# EAGLE design EEPROM ONLY memory board (EAGLE 9.3.0)
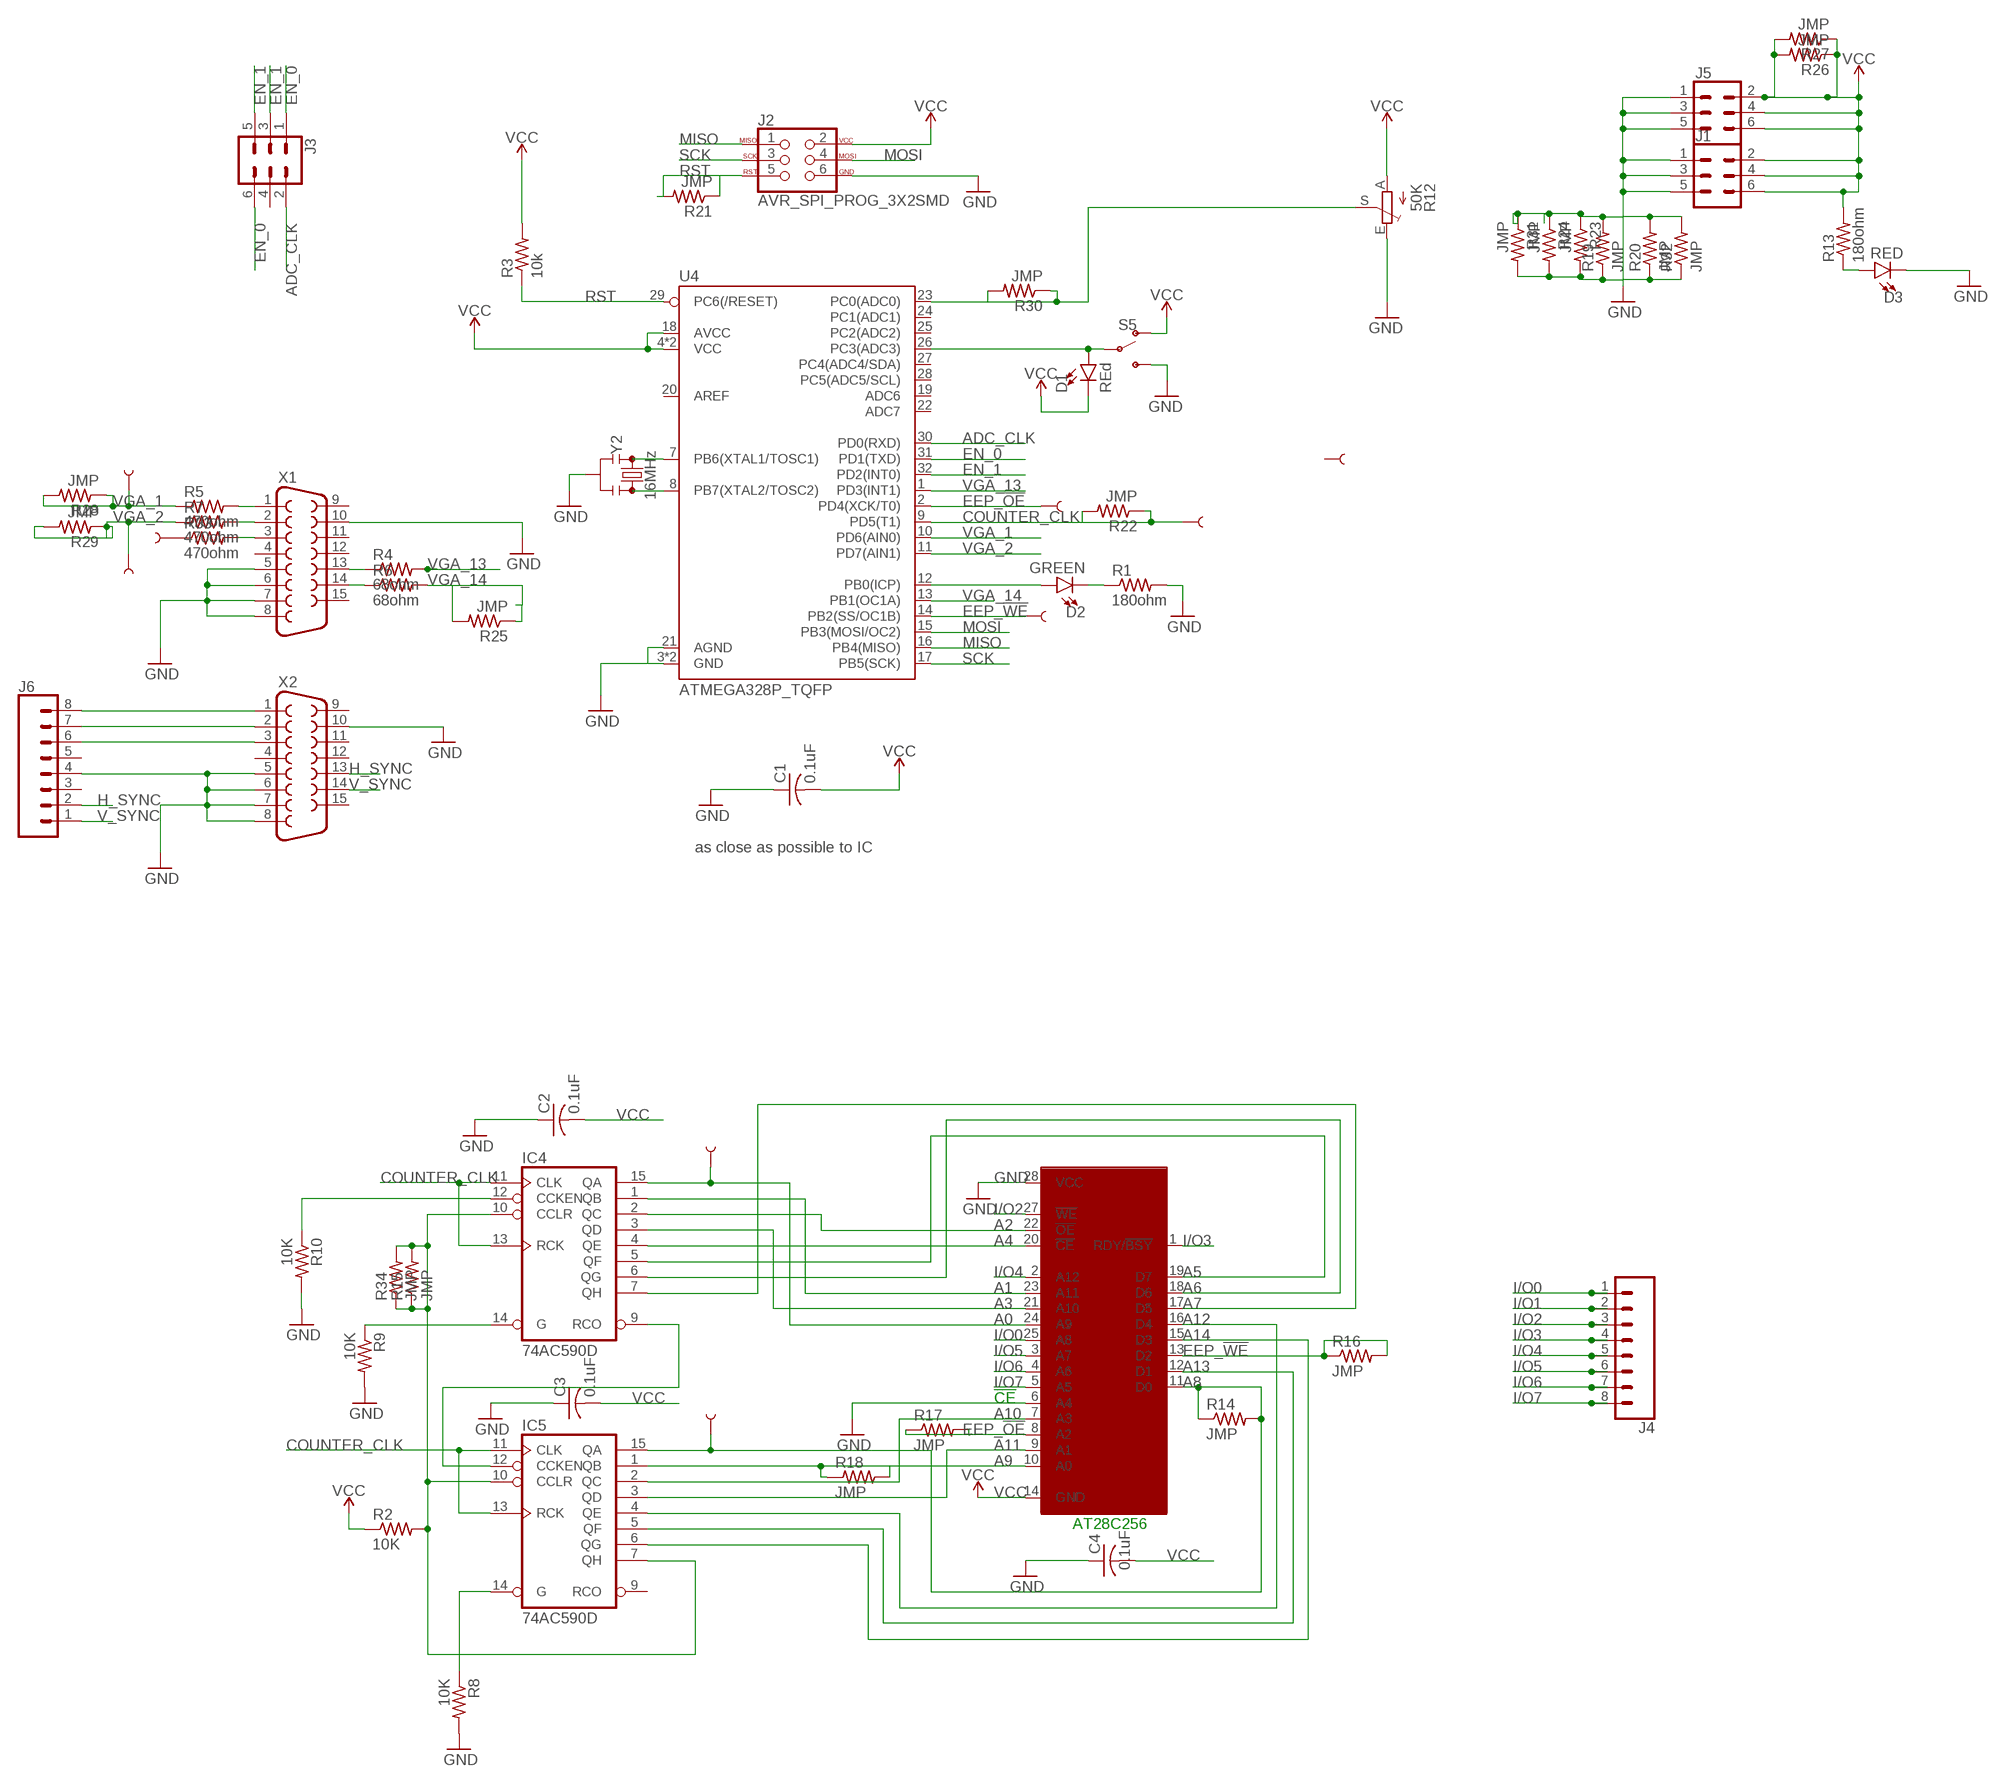
[diagram p0: schematic, sheet 1]

## Parts
C1  0.1uF  C-USC1206  [C1206]
C2  0.1uF  C-USC1206  [C1206]
C3  0.1uF  C-USC1206  [C1206]
C4  0.1uF  C-USC1206  [C1206]
D1  REd  LED-RED1206  [LED-1206]
D2  GREEN  LED-RED1206  [LED-1206]
D3  RED  LED-RED1206  [LED-1206]
IC1  28C64AVS  [VSOP28-8X13]
IC4  74AC590D  [SO16]
IC5  74AC590D  [SO16]
J1  CONN_03X2FEMALE_SMD  [2X3_SMD]
J2  AVR_SPI_PROG_3X2SMD  [2X3_SMT_POSTS]
J3  CONN_03X2FEMALE_SMD  [2X3_SMD]
J4  CONN_08SMD-STRAIGHT-ALT-FEMALE  [1X08_SMD_ALT]
J5  CONN_03X2FEMALE_SMD  [2X3_SMD]
J6  CONN_08SMD-STRAIGHT-ALT-FEMALE  [1X08_SMD_ALT]
R1  180ohm  R-US_R1206  [R1206]
R2  10K  R-US_R1206  [R1206]
R3  10k  R-US_R1206  [R1206]
R4  68ohm  R-US_R1206  [R1206]
R5  470ohm  R-US_R1206  [R1206]
R6  68ohm  R-US_R1206  [R1206]
R7  470ohm  R-US_R1206  [R1206]
R8  10K  R-US_R1206  [R1206]
R9  10K  R-US_R1206  [R1206]
R10  10K  R-US_R1206  [R1206]
R12  50K  TRIM_EU-CA9V  [CA9V]
R13  180ohm  R-US_R1206  [R1206]
R14  JMP  R-US_R1206  [R1206]
R15  JMP  R-US_R1206  [R1206]
R16  JMP  R-US_R1206  [R1206]
R17  JMP  R-US_R1206  [R1206]
R18  JMP  R-US_R1206  [R1206]
R19  JMP  R-US_R1206  [R1206]
R20  JMP  R-US_R1206  [R1206]
R21  JMP  R-US_R1206  [R1206]
R22  JMP  R-US_R1206  [R1206]
R23  JMP  R-US_R1206  [R1206]
R24  JMP  R-US_R1206  [R1206]
R25  JMP  R-US_R1206  [R1206]
R26  JMP  R-US_R1206  [R1206]
R27  JMP  R-US_R1206  [R1206]
R28  JMP  R-US_R1206  [R1206]
R29  JMP  R-US_R1206  [R1206]
R30  JMP  R-US_R1206  [R1206]
R31  JMP  R-US_R1206  [R1206]
R32  JMP  R-US_R1206  [R1206]
R33  470ohm  R-US_R1206  [R1206]
R34  JMP  R-US_R1206  [R1206]
RX1  TEST-POINT3  [PAD.03X.03]
RX2  TEST-POINT3  [PAD.03X.03]
RX3  TEST-POINT3  [PAD.03X.03]
RX4  TEST-POINT3  [PAD.03X.03]
RX5  TEST-POINT3  [PAD.03X.03]
RX6  TEST-POINT3  [PAD.03X.03]
RX7  TEST-POINT3  [PAD.03X.03]
RX8  TEST-POINT3  [PAD.03X.03]
RX9  TEST-POINT3  [PAD.03X.03]
S5  SWITCH-SPDT-SMD-AYZ0202  [SWITCH_DPDT_SMD_AYZ0202]
U4  ATMEGA328P_TQFP  [TQFP32-08]
X1  F15HP  [F15HP]
X2  F15HP  [F15HP]
Y2  16MHz  RESONATOR-16MHZSMD_3.2X1.3  [RESONATOR-SMD-3.2X1.3]

## Nets
A0: IC1.24(A9) IC4.15(QA) RX5.P$1
A1: IC1.23(A11) IC4.1(QB)
A2: IC1.22(!OE) IC4.2(QC)
A3: IC1.21(A10) IC4.3(QD)
A4: IC1.20(!CE) IC4.4(QE)
A5: IC1.19(D7) IC4.5(QF)
A6: IC1.18(D6) IC4.6(QG)
A7: IC1.17(D5) IC4.7(QH)
A8: IC1.11(D0) IC5.15(QA) R14.1 R14.2 RX6.P$1
A9: IC1.10(A0) IC5.1(QB) R18.1 R18.2
A10: IC1.7(A3) IC5.2(QC)
A11: IC1.9(A1) IC5.3(QD)
A12: IC1.16(D4) IC5.4(QE)
A13: IC1.12(D1) IC5.5(QF)
A14: IC1.15(D3) IC5.6(QG)
ADC_CLK: J3.2 U4.30(PD0(RXD))
COUNTER_CLK: IC4.11(CLK) IC4.13(RCK) IC5.11(CLK) IC5.13(RCK) R22.1 R22.2 RX3.P$1 U4.9(PD5(T1))
EEP_!OE: IC1.8(A2) R17.1 R17.2 RX2.P$1 U4.2(PD4(XCK/T0))
EEP_!WE: IC1.13(D2) R16.1 R16.2 RX4.P$1 U4.14(PB2(SS/OC1B))
EN_0: J3.1 J3.6 U4.31(PD1(TXD))
EN_1: J3.3 J3.5 U4.32(PD2(INT0))
GND: C1.1 C2.1 C3.1 C4.1 D3.C IC1.6(A4) IC1.28(VCC) J1.1 J1.3 J1.5 J2.6 J5.1 J5.3 J5.5 J6.4 R1.2 R8.2 R9.2 R10.2 R12.E R19.1 R19.2 R20.1 R20.2 R23.1 R23.2 R24.1 R24.2 R31.1 R31.2 R32.1 R32.2 S5.3(S) U4.3(GND) U4.5(GND) U4.21(AGND) X1.5 X1.6 X1.7 X1.8 X1.10 X2.5 X2.6 X2.7 X2.8 X2.10 Y2.2
H_SYNC: J6.2 X2.13
I/O0: IC1.25(A8) J4.1
I/O1: J4.2
I/O2: IC1.27(!WE) J4.3
I/O3: IC1.1(RDY/!BSY) J4.4
I/O4: IC1.2(A12) J4.5
I/O5: IC1.3(A7) J4.6
I/O6: IC1.4(A6) J4.7
I/O7: IC1.5(A5) J4.8
MISO: J2.1 U4.16(PB4(MISO))
MOSI: J2.4 U4.15(PB3(MOSI/OC2))
N$1: R5.2 X1.1
N$2: R7.2 X1.2
N$3: D3.A R13.1
N$4: R4.1 X1.13
N$5: R6.1 X1.14
N$6: IC4.9(RCO) IC5.12(CCKEN)
N$7: U4.7(PB6(XTAL1/TOSC1)) Y2.1
N$8: U4.8(PB7(XTAL2/TOSC2)) Y2.3
N$9: IC5.14(G) R8.1
N$10: IC4.14(G) R9.1
N$11: IC4.12(CCKEN) R10.1
N$12: IC4.10(CCLR) IC5.7(QH) IC5.10(CCLR) R2.2 R15.1 R15.2 R34.1 R34.2
N$13: D1.A S5.2(P) U4.26(PC3(ADC3))
N$14: J6.8 X2.1
N$15: J6.7 X2.2
N$16: D2.A U4.12(PB0(ICP))
N$17: R33.2 X1.3
N$18: D2.C R1.1
N$19: R33.1 RX7.P$1
N$23: J6.6 X2.3
N$86: R12.S R30.1 R30.2 U4.23(PC0(ADC0))
RST: J2.5 R3.1 R21.1 R21.2 U4.29(PC6(/RESET))
SCK: J2.3 U4.17(PB5(SCK))
V_SYNC: J6.1 X2.14
VCC: C1.2 C2.2 C3.2 C4.2 D1.C IC1.14(GND) J1.2 J1.4 J1.6 J2.2 J5.2 J5.4 J5.6 R2.1 R3.2 R12.A R13.2 R26.1 R26.2 R27.1 R27.2 S5.1(O) U4.4(VCC) U4.6(VCC) U4.18(AVCC)
VGA_1: R5.1 R28.1 R28.2 RX8.P$1 U4.10(PD6(AIN0))
VGA_2: R7.1 R29.1 R29.2 RX9.P$1 U4.11(PD7(AIN1))
VGA_13: R4.2 U4.1(PD3(INT1))
VGA_14: R6.2 R25.1 R25.2 U4.13(PB1(OC1A))
Unconnected: IC5.9(RCO) J3.4 J6.3 J6.5 RX1.P$1 U4.19(ADC6) U4.20(AREF) U4.22(ADC7) U4.24(PC1(ADC1)) U4.25(PC2(ADC2)) U4.27(PC4(ADC4/SDA)) U4.28(PC5(ADC5/SCL)) X1.4 X1.9 X1.11 X1.12 X1.15 X2.4 X2.9 X2.11 X2.12 X2.15

## Notes on the sheet
- as close as possible to IC
- !CE
- AT28C256

## Power pins joined to a net without a drawn wire
GND: IC4.8(GND) IC5.8(GND)
VCC: IC4.16(VCC) IC5.16(VCC)

## Library data of the parts
C1-C4 = adafruit:C-US: CAPACITOR, American symbol
D1 D2 = SparkFun-LED:LED-RED: Red SMD LED Used in manufacturing of most products at SparkFun Packages: 0603 - SMD 0603 package [Product Link] <http://docs.avagotech.com/docs/AV02-0551EN> 0603 SMART - SMD 0603 SMART package ( more efficient and expensive)[Product Link] <http://www.osram-os.com/Graphics/XPic2/00077099_0.pdf> 1206 - SMD1206 package [Product Link] <https://www.sparkfun.com/datasheets/DevTools/LilyPad/Q150OVS4.pdff> SparkFun Products: Pro Mini 328 -5V <https://www.sparkfun.com/products/821> RedBoard <https://www.sparkfun.com/products/12757> IOIO-OTG <https://www.sparkfun.com/products/13613>; PROD_ID: DIO-09912; VALUE: RED
D3 = SparkFun-LED:LED-RED: Red SMD LED Used in manufacturing of most products at SparkFun Packages: 0603 - SMD 0603 package [Product Link] <http://docs.avagotech.com/docs/AV02-0551EN> 0603 SMART - SMD 0603 SMART package ( more efficient and expensive)[Product Link] <http://www.osram-os.com/Graphics/XPic2/00077099_0.pdf> 1206 - SMD1206 package [Product Link] <https://www.sparkfun.com/datasheets/DevTools/LilyPad/Q150OVS4.pdff> SparkFun Products: Pro Mini 328 -5V <https://www.sparkfun.com/products/821> RedBoard <https://www.sparkfun.com/products/12757> IOIO-OTG <https://www.sparkfun.com/products/13613>; PROD_ID: DIO-09912
IC1 = microchip:28*64A: CMOS EEPROM 64 K (8 K x 8), low voltage; OC_FARNELL: unknown; OC_NEWARK: unknown
IC4 IC5 = 74xx-eu:74*590: 8-bit binary COUNTER, output register
J1 J3 J5 = SparkFun-Connectors:CONN_03X2: Multi connection point. Often used as Generic Header-pin footprint for 0.1 inch spaced/style header connections You can populate with any combo of single row headers, but if you'd like an exact match, check these: Header - 2x3 (Male, 0.1") <https://www.sparkfun.com/products/12807> (PRT-12807) Header - 2x3 (Female, 0.1") <https://www.sparkfun.com/products/13010> (PRT-13010) 2x3 Pin Shrouded Header <https://www.sparkfun.com/products/10877> (PRT-10877) On any of the 0.1 inch spaced packages, you can populate with these: Break Away Headers - Straight <https://www.sparkfun.com/products/116> (PRT-00116) Break Away Male Headers - Right Angle <https://www.sparkfun.com/products/553> (PRT-00553) Female Headers <https://www.sparkfun.com/products/115> (PRT-00115) Break Away Headers - Machine Pin <https://www.sparkfun.com/products/117> (PRT-00117) Break Away Female Headers - Swiss Machine Pin <https://www.sparkfun.com/products/743> (PRT-00743) Special note: the shrouded connector mates well with our 3x2 ribbon cables: Ribbon Crimp Connector - 6-pin (2x3, Female) <https://www.sparkfun.com/products/10651> (PRT-10651) Ribbon Cable - 6 wire (15ft) <https://www.sparkfun.com/products/10646> (PRT-10646); PROD_ID: CONN-11290
J2 = SparkFun-Connectors:AVR_SPI_PROG_3X2: AVR ISP 6 Pin This is the reduced ISP connector for AVR programming. Common on Arduino. This footprint will take up less PCB space and can be used with a 10-pin to 6-pin adapter such as SKU: BOB-08508 **Special note about "TEST_POINT" package. The stop mask is on the top side, so if you want your programming test points to be on the bottom of your board, make sure to place this package on the bottom side of the board. This also ensure that the orientation to program from the bottom side will be correct. SparkFun Products: SparkFun ISP Pogo Adapter <https://www.sparkfun.com/products/11591> - NS Tiny AVR Programmer <https://www.sparkfun.com/products/11801> -PTH
J4 J6 = SparkFun-Connectors:CONN_08: Multi connection point. Often used as Generic Header-pin footprint for 0.1 inch spaced/style header connections On any of the 0.1 inch spaced packages, you can populate with these: Break Away Headers - Straight <https://www.sparkfun.com/products/116> (PRT-00116) Break Away Male Headers - Right Angle <https://www.sparkfun.com/products/553> (PRT-00553) Female Headers <https://www.sparkfun.com/products/115> (PRT-00115) Break Away Headers - Machine Pin <https://www.sparkfun.com/products/117> (PRT-00117) Break Away Female Headers - Swiss Machine Pin <https://www.sparkfun.com/products/743> (PRT-00743) Arduino Stackable Header - 8 Pin <https://www.sparkfun.com/products/9279> (PRT-09279) For SCREWTERMINALS and SPRING TERMINALS visit here: Screw Terimnals on SparkFun.com <https://www.sparkfun.com/search/results?term=Screw+Terminals> (5mm/3.5mm/2.54mm spacing) This device is also useful as a general connection point to wire up your design to another part of your project. Our various solder wires solder well into these plated through hole pads. Hook-Up Wire - Assortment (Stranded, 22 AWG) <https://www.sparkfun.com/products/11375> (PRT-11375) Hook-Up Wire - Assortment (Solid Core, 22 AWG) <https://www.sparkfun.com/products/11367> (PRT-11367) View the entire wire category on our website here <https://www.sparkfun.com/categories/141> Special notes: Molex polarized connector foot print use with SKU : PRT-08231 with associated crimp pins and housings. 1MM SMD Version SKU: PRT-10208 NOTES ON THE VARIANTS LOCK and LOCK_LONGPADS... This footprint was designed to help hold the alignment of a through-hole component (i.e. 6-pin header) while soldering it into place. You may notice that each hole has been shifted either up or down by 0.005 of an inch from it's more standard position (which is a perfectly straight line). This slight alteration caused the pins (the squares in the middle) to touch the edges of the holes. Because they are alternating, it causes a "brace" to hold the component in place. 0.005 has proven to be the perfect amount of "off-center" position when using our standard breakaway headers. Although looks a little odd when you look at the bare footprint, once you have a header in there, the alteration is very hard to notice. Also,if you push a header all the way into place, it is covered up entirely on the bottom side.; PROD_ID: CONN-10204; SF_ID: PRT-11543
R1-R10 R13-R34 = adafruit:R-US_: RESISTOR, American symbol
R12 = pot:TRIM_EU-: POTENTIOMETER
RX1-RX9 = SparkFun-Connectors:TEST-POINT: SparkFun Test Points Bare copper test points for troubleshooting or In-Circuit-Testing. These are used by our Production team for verifying production board runs using pogo-pins on test beds. SparkFun Products: SparkFun LSM9DS1 Breakout <https://www.sparkfun.com/products/13284> SparkFun PSOC <https://www.sparkfun.com/products/13714> SparkFun Load Cell Amplifier <https://www.sparkfun.com/products/13879>
S5 = SparkFun-Switches:SWITCH-SPDT: Single Pole, Double Throw (SPDT) Switch Single-pole, double-throw (SPDT) switch. Variant Overview SMD-AYZ0202 Surface Mount DPDT Switch <https://www.sparkfun.com/products/597> (COM-00597) Used on e.g. LilyPad Arduino USB - ATmega32U4 Board <https://www.sparkfun.com/products/12049> PTH-11.6X4.0MM SPDT Mini Power Switch <https://www.sparkfun.com/products/102> (COM-00102) Used on e.g. SparkFun Simon Says - Through-Hole Soldering Kit <https://www.sparkfun.com/products/10547> (KIT-10547) PTH-11.6X4.0MM-KIT KIT version of SPDT Mini Power Switch - Simplifies soldering by removing tStop of switch pins - only one side can be soldered. PTH-11.6X4.0MM-LOCK LOCK version of SPDT Mini Power Switch - Offset pins hold switch in place for easier soldering. SMD-RIGHT-ANGLE Surface Mount Right Angle Switch <https://www.sparkfun.com/products/10860> (COM-10860) Used on e.g. SparkFun ESP8266 Thing <https://www.sparkfun.com/products/13231>; PROD_ID: SWCH-08179; SF_ID: COM-00597
U4 = SparkFun-IC-Microcontroller:ATMEGA328P_TQFP: Popular 328P in QFP Storefront component: ATmega328 - TQFP <https://www.sparkfun.com/products/13448> (COM-13448) Datasheet <http://www.sparkfun.com/datasheets/Components/SMD/ATMega328.pdf> SparkFun Products SparkFun RedBoard - Programmed with Arduino <https://www.sparkfun.com/products/12757> (DEV-12757) Arduino Pro Mini 328 - 5V/16MHz <https://www.sparkfun.com/products/11113> (DEV-11113) Arduino Pro Mini 328 - 3.3V/8MHz <https://www.sparkfun.com/products/11114> (DEV-11114) SparkFun OpenLog <https://www.sparkfun.com/products/13712> (DEV-13712) SparkFun MicroView - OLED Arduino Module <https://www.sparkfun.com/products/12923> (DEV-12923) SparkFun Digital Sandbox <https://www.sparkfun.com/products/12651> (DEV-12651) SparkFun PicoBoard <https://www.sparkfun.com/products/11888> (WIG-11888) Arduino Fio <https://www.sparkfun.com/products/10116> (DEV-10116) LilyPad Arduino 328 Main Board <https://www.sparkfun.com/products/13342> (DEV-13342) SparkFun RedStick <https://www.sparkfun.com/products/13741> (DEV-13741) LilyPad MP3 <https://www.sparkfun.com/products/11013> (DEV-11013) LilyPad Arduino SimpleSnap <https://www.sparkfun.com/products/10941> (DEV-10941) SparkFun Stepoko <https://www.sparkfun.com/products/13899> (ROB-13899) SparkFun Geiger Counter <https://www.sparkfun.com/products/11345> (SEN-11345) SparkFun EL Sequencer <https://www.sparkfun.com/products/12781> (COM-12781) Arduino Pro 328 - 5V/16MHz <https://www.sparkfun.com/products/10915> (DEV-10915) CryptoCape <https://www.sparkfun.com/products/12773> (DEV-12773) SparkFun IR Thermometer Evaluation Board - MLX90614 <https://www.sparkfun.com/products/10740> (SEN-10740) SparkFun RedBot Mainboard <https://www.sparkfun.com/products/12097> (ROB-12097) Arduino Pro 328 - 3.3V/8MHz <https://www.sparkfun.com/products/10914> (DEV-10914) SparkFun Block for Intel® Edison - Arduino <https://www.sparkfun.com/products/13036> (DEV-13036) SparkFun Simon Says - Surface Mount Soldering Kit <https://www.sparkfun.com/products/10935> (KIT-10935) SparkFun 7-Segment Serial Display - Red <https://www.sparkfun.com/products/11441> (COM-11441) SparkFun 7-Segment Serial Display - White <https://www.sparkfun.com/products/11629> (COM-11629) SparkFun 7-Segment Serial Display - Yellow <https://www.sparkfun.com/products/11443> (COM-11443) SparkFun 7-Segment Serial Display - Kelly Green <https://www.sparkfun.com/products/11440> (COM-11440) SparkFun 7-Segment Serial Display - Blue <https://www.sparkfun.com/products/11442> (COM-11442) SparkFun OpenSegment Serial Display - 20mm (Blue) <https://www.sparkfun.com/products/11647> (COM-11647) SparkFun OpenSegment Serial Display - 20mm (Green) <https://www.sparkfun.com/products/11646> (COM-11646) SparkFun OpenSegment Serial Display - 20mm (White) <https://www.sparkfun.com/products/11648> (COM-11648) SparkFun OpenSegment Serial Display - 20mm (Red) <https://www.sparkfun.com/products/11644> (COM-11644) SparkFun OpenSegment Serial Display - 20mm (Yellow) <https://www.sparkfun.com/products/11645> (COM-11645) SparkFun OpenSegment Shield <https://www.sparkfun.com/products/13190> (DEV-13190); PROD_ID: IC-09069
X1 X2 = adafruit:F15: SUB-D HDH is also known as a 'right angle VGA' connector
Y2 = SparkFun-Clocks:RESONATOR-16MHZ: 16MHz Resonator Digikey Example <http://www.digikey.com/product-detail/en/murata-electronics-north-america/CSTCE16M0V53-R0/490-1198-1-ND/584635> Frequency: 16MHz Frequency Stability: ±0.3% Frequency Tolerance: ±0.5% Capacitance: 15pF SparkFun Products SparkFun OpenLog <https://www.sparkfun.com/products/13712> SparkFun MicroView - OLED Arduino Module <https://www.sparkfun.com/products/12923>; PROD_ID: XTAL-08900

## Board
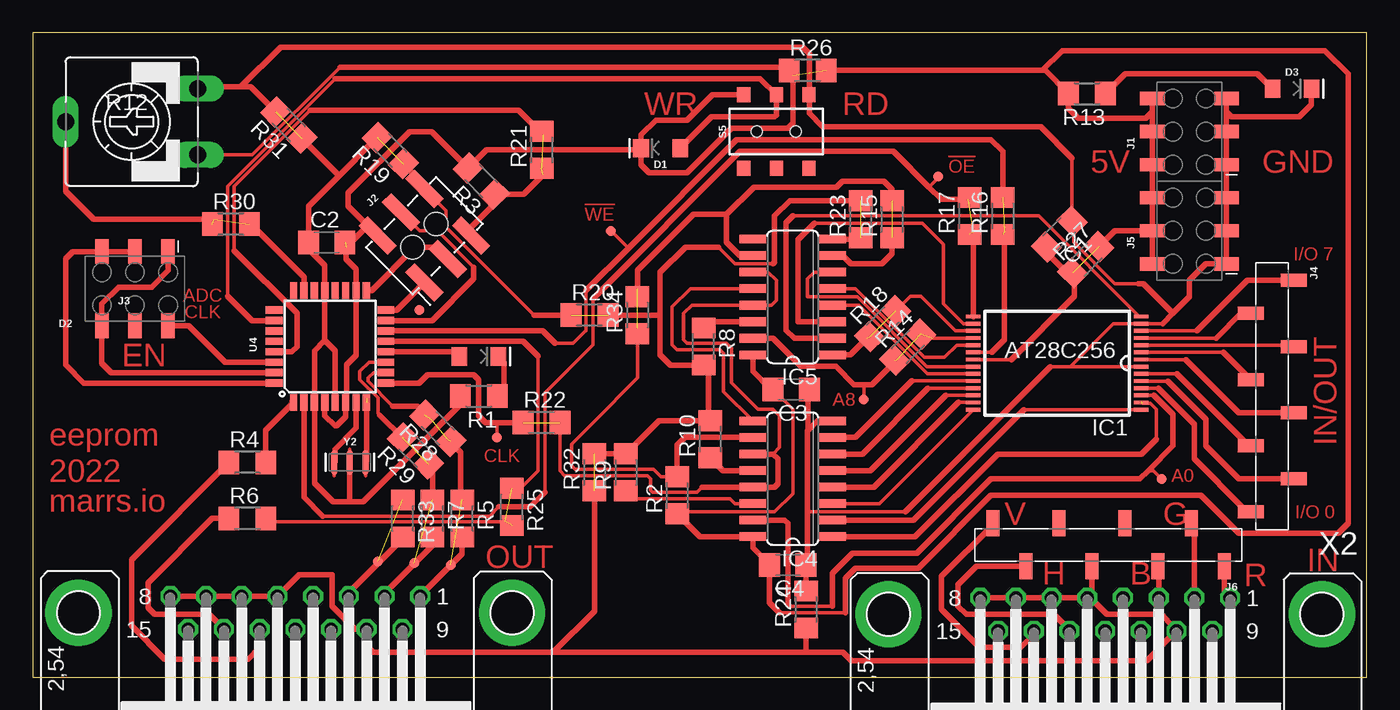
[diagram p1: board, top side]

Size 102.54 x 49.52 mm. Coordinates in mm from the lower left corner, seen from the top.
Outline: 0,0 102.54,0 102.54,49.52 0,49.52 0,0
Copper layers (1*16): Top 0.035mm / dielectric 1.5mm / Bottom 0.035mm
Design rules "default *": minimum track width 10mil, minimum drill 0.35mm, track to track 16mil, track to pad 6mil, pad to pad 6mil, via to via 6mil, smd to smd 16mil, copper to edge 40mil, drill to drill 6mil, minimum pad ring 10mil, minimum via ring 8mil, stop-mask expansion 4mil, vias tented up to drill 0mil, thermal gap 10mil

### Footprints (pad centres in the part's own frame; a part is rotated, then mirrored left to right if it is on the bottom)
C1206 = smd 1.6 x 1.8: 1 -1.4,0; 2 1.4,0
LED-1206 = smd 1.2 x 1.4: A -1.5,0; C 1.5,0
VSOP28-8X13 = smd 0.3 x 1.1: 1 0.275,-6.45; 2 0.825,-6.45; 3 1.375,-6.45; 4 1.925,-6.45; 5 2.475,-6.45; 6 3.025,-6.45; 7 3.575,-6.45; 8 3.575,6.45; 9 3.025,6.45; 10 2.475,6.45; 11 1.925,6.45; 12 1.375,6.45; 13 0.825,6.45; 14 0.275,6.45; 15 -0.275,6.45; 16 -0.825,6.45; 17 -1.375,6.45; 18 -1.925,6.45; 19 -2.475,6.45; 20 -3.025,6.45; 21 -3.575,6.45; 22 -3.575,-6.45; 23 -3.025,-6.45; 24 -2.475,-6.45; 25 -1.925,-6.45; 26 -1.375,-6.45; 27 -0.825,-6.45; 28 -0.275,-6.45
SO16 = smd 0.66 x 2.032: 1 -4.445,-3.073; 2 -3.175,-3.073; 3 -1.905,-3.073; 4 -0.635,-3.073; 5 0.635,-3.073; 6 1.905,-3.073; 7 3.175,-3.073; 8 4.445,-3.073; 9 4.445,3.073; 10 3.175,3.073; 11 1.905,3.073; 12 0.635,3.073; 13 -0.635,3.073; 14 -1.905,3.073; 15 -3.175,3.073; 16 -4.445,3.073
2X3_SMD = smd 1.02 x 1.9: 1 -2.54,-2.85; 2 -2.54,2.85; 3 0,-2.85; 4 0,2.85; 5 2.54,-2.85; 6 2.54,2.85
2X3_SMT_POSTS = smd 1 x 3.17: 1 -2.54,-2.54; 2 -2.54,2.54; 3 0,-2.54; 4 0,2.54; 5 2.54,-2.54; 6 2.54,2.54 | hole 1.8: -1.27,0; 1.27,0
1X08_SMD_ALT = smd 1 x 2: 1 0,-1.65; 2 -2.54,1.65; 3 -5.08,-1.65; 4 -7.62,1.65; 5 -10.16,-1.65; 6 -12.7,1.65; 7 -15.24,-1.65; 8 -17.78,1.65
R1206 = smd 1.6 x 1.803: 1 -1.422,0; 2 1.422,0
CA9V = drill 1.321 long: A -2.54,-5.08; E 2.54,-5.08; S 0,5.08
PAD.03X.03 = smd 0.762 x 0.762: P$1 0,0
SWITCH_DPDT_SMD_AYZ0202 = smd 1 x 1.15: 1 -2.5,2.825; 2 0,2.825; 3 2.5,2.825; 4 -2.5,-2.825; 5 0,-2.825; 6 2.5,-2.825 | hole 0.85: 1.5,0; -1.5,0
TQFP32-08 = smd 1.27 x 0.559: 1 -4.293,2.8; 2 -4.293,2; 3 -4.293,1.2; 4 -4.293,0.4; 5 -4.293,-0.4; 6 -4.293,-1.2; 7 -4.293,-2; 8 -4.293,-2.8; 17 4.293,-2.8; 18 4.293,-2; 19 4.293,-1.2; 20 4.293,-0.4; 21 4.293,0.4; 22 4.293,1.2; 23 4.293,2; 24 4.293,2.8 | smd 0.559 x 1.27: 9 -2.8,-4.293; 10 -2,-4.293; 11 -1.2,-4.293; 12 -0.4,-4.293; 13 0.4,-4.293; 14 1.2,-4.293; 15 2,-4.293; 16 2.8,-4.293; 25 2.8,4.293; 26 2,4.293; 27 1.2,4.293; 28 0.4,4.293; 29 -0.4,4.293; 30 -1.2,4.293; 31 -2,4.293; 32 -2.8,4.293
F15HP = drill 1.016 octagon: 1 -9.601,-1.27; 2 -6.858,-1.27; 3 -4.115,-1.27; 4 -1.372,-1.27; 5 1.372,-1.27; 6 4.115,-1.27; 7 6.858,-1.27; 8 9.601,-1.27; 9 -8.23,1.27; 10 -5.486,1.27; 11 -2.743,1.27; 12 0,1.27; 13 2.743,1.27; 14 5.486,1.27; 15 8.23,1.27 | drill 3.302 pad 5.08: G1 -16.662,0; G2 16.662,0
RESONATOR-SMD-3.2X1.3 = smd 0.45 x 1.905: 1 -1.2,0; 2 0,0; 3 1.2,0

### Placement (x,y rotation side)
C1  78.89,34.04 225 top
C2  22.61,33.4 0 top
C3  58.29,22.1 180 top
C4  58.04,8.64 180 top
D1  48.26,40.64 180 top
D2  34.29,24.64 0 top
D3  96.77,45.21 0 top
IC1  78.74,24.13 90 top
IC4  58.42,15.24 90 top
IC5  58.42,29.21 90 top
J1  88.9,41.91 90 top
J2  30.11,33.92 45 top
J3  7.87,29.84 180 top
J4  95.25,12.7 270 top
J5  88.9,34.29 90 top
J6  73.79,10.16 180 top
R1  34.29,21.59 180 top
R2  49.53,13.97 90 top
R3  34.47,38.1 135 top
R4  16.51,16.51 0 top
R5  33.02,12.19 270 top
R6  16.51,12.19 0 top
R7  30.73,12.19 270 top
R8  51.56,25.4 270 top
R9  45.59,15.75 90 top
R10  52.07,18.29 90 top
R12  7.62,42.67 90 top
R13  81.03,44.83 180 top
R14  67.26,25.36 45 top
R15  66.04,35.18 90 top
R16  74.55,35.43 90 top
R17  72.01,35.43 90 top
R18  65.34,27.16 45 top
R19  27.48,40.46 135 top
R20  42.8,27.81 0 top
R21  39.12,40.51 90 top
R22  39.12,19.56 0 top
R23  63.63,35.18 90 top
R24  59.44,5.21 90 top
R25  36.83,13.08 270 top
R26  59.56,46.61 0 top
R27  80.94,32.07 45 top
R28  31.14,19.12 135 top
R29  29.43,17.38 135 top
R30  15.24,34.8 0 top
R31  19.68,42.42 135 top
R32  43.18,15.75 90 top
R33  28.45,12.19 270 top
R34  46.48,27.81 90 top
RX1  29.72,28.19 0 top
RX2  69.6,38.48 0 top
RX3  35.69,18.41 0 top
RX4  44.45,34.29 0 top
RX5  86.74,15.24 0 top
RX6  63.88,21.34 0 top
RX7  26.54,8.89 0 top
RX8  32.13,8.64 0 top
RX9  29.34,8.76 0 top
S5  57.15,41.91 0 top
U4  22.86,25.4 90 top
X1  20.19,4.95 180 top
X2  82.42,4.83 180 top
Y2  24.38,16.51 0 top

### Tracks (layer width: path | path; a pad name or v marks a point on that pad's centre or on a via)
A0
  Top 0.254: 61.47,5.46 58.17,5.46 | IC1.24 86.17,21.65 | RX5.P$1 86.11,15.87 85.72,15.87
  Top 0.406: IC4.15 57.78,12.06 58.04,11.81 58.04,5.59 58.17,5.46 | 86.17,21.65 87.63,20.19 87.63,17.78 85.72,15.87 85.09,15.24 73.66,15.24 67.94,9.52 62.99,9.52 61.47,8 61.47,5.46
A1  (1 unrouted)
  Top 0.254: 85.28,21.06 85.89,21.06 86.36,20.59 86.36,18.29
  Top 0.406: IC4.1 67.82,10.79 74.17,17.14 85.22,17.14 86.36,18.29
A2
  Top 0.254: 76.18,20.55 IC1.22
  Top 0.406: IC4.2 67.69,12.06 76.18,20.55
A3
  Top 0.254: IC1.21 65.07,13.33 IC4.3
A4
  Top 0.254: IC1.20 71.15,21.11
  Top 0.406: IC4.4 64.65,14.6 71.15,21.11
A5
  Top 0.254: IC1.19 70.17,21.65
  Top 0.406: IC4.5 64.39,15.87 70.17,21.65
A6
  Top 0.254: IC1.18 68.81,22.21
  Top 0.406: IC4.6 63.75,17.14 68.81,22.21
A7
  Top 0.254: 67.59,22.75 IC1.17
  Top 0.406: IC4.7 63.25,18.41 67.59,22.75
A8  (3 unrouted)
  Top 0.254: IC1.11 69.19,26.05 | RX6.P$1 63.88,22.48
  Top 0.406: IC5.15 56.9,26.04 59.05,23.88 61.72,23.88 63.12,22.48 63.88,22.48 64.52,22.48 66.42,24.38
A9  (2 unrouted)
  Top 0.254: IC1.10 70.93,26.61 68.26,29.27 67.45,29.27 R18.2
  Top 0.406: IC5.1 62.87,24.76 64.14,26.04
A10
  Top 0.254: IC1.7 85.06,27.71 77.33,35.43 58.42,35.43
  Top 0.406: 58.42,35.43 57.91,34.92 57.91,26.67 58.55,26.04 IC5.2
A11
  Top 0.254: 60.07,34.87 68.38,34.87 70,33.25 70,28.68 71.53,27.15 IC1.9
  Top 0.406: 60.07,34.87 58.8,33.6 58.8,27.3 IC5.3
A12
  Top 0.254: IC5.4 63.5,28.57 68.77,23.3 IC1.16
A13
  Top 0.254: IC5.5 63.25,29.84 68.52,24.57 70.09,24.57 71.02,25.5 IC1.12
A14
  Top 0.254: IC1.15 68.73,23.86 63.37,29.21 59.56,29.21 59.56,30.61 60.07,31.11 IC5.6
ADC_CLK
  Top 0.406: J3.2 11.99,27 14.79,24.2 U4.30
COUNTER_CLK  (1 unrouted)
  Top 0.254: 56.9,17.14 57.4,17.65 57.4,20.07 56.9,20.57 55.75,20.57 53.72,22.61 53.72,25.27 53.34,25.65 50.29,25.65 50.04,25.91 50.04,27.94 50.67,28.57 IC5.13 56.77,28.57 57.15,28.96 57.15,30.48 56.52,31.11 IC5.11 | 51.44,14.6 51.05,14.22 47.62,14.22 47.5,14.35 47.5,15.24 47.24,15.49 40.89,15.49 40.54,15.85 R22.2 | RX3.P$1 35.69,19.43 35.56,19.56
  Top 0.406: IC4.11 56.9,17.14 57.28,16.76 57.28,14.86 57.02,14.6 IC4.13 51.44,14.6 | 27.05,22.5 U4.9 29.71,22.6 30.35,23.24 33.91,23.24 34.29,22.86 34.29,20.07 34.8,19.56 35.56,19.56 R22.1
EEP_!OE  (2 unrouted)
  Top 0.254: 43.05,29.08 43.05,25.53 39.37,21.84 39.37,14.22 | 22.29,12.38 35.12,12.38 35.81,13.08 | RX2.P$1 69.6,38.35 68.9,37.66
  Top 0.406: IC1.8 72.29,34.14 72.26,34.16 | U4.2 20.86,13.81 22.29,12.38 | 43.05,29.08 54.36,40.39 66.17,40.39 68.9,37.66 69.85,36.7 71.86,36.7 R17.2 | 39.37,14.22 38.23,13.08 35.81,13.08
EEP_!WE  (2 unrouted)
  Top 0.254: IC1.13 73.72,24.96 | 42.55,26.6 42.55,26.67 | 42.55,26.67 42.55,29.72 | 42.55,26.67 41.53,25.65 40.13,25.65 | RX4.P$1 45.78,32.96
  Top 0.406: 73.72,24.96 74.68,25.91 74.68,34.16 | R16.2 74.55,40.39 73.66,41.27 54.1,41.27 45.78,32.96 42.55,29.72 | 40.13,25.65 39.19,26.6 U4.14
EN_0
  Top 0.406: J3.1 10.41,31.24 9.14,29.97 6.6,29.97 5.33,28.7 J3.6 5.33,24.13 6.06,23.4 U4.31
EN_1
  Top 0.406: J3.3 J3.5 3.1,32.69 2.54,32.13 2.54,24 3.94,22.6 U4.32
GND  (5 unrouted)
  Top 0.152: 79.73,23.86 IC1.28
  Top 0.254: 79.73,23.86 83.03,27.15 IC1.6 86.84,27.15 | 30.63,36.98 31.78,35.84 31.78,34.57 38.53,27.81 | 52.7,33.02 53.98,31.75 56.9,31.75 | 59.56,12.7 67.06,12.7 | 78.21,23.86 IC1.28 | 79.88,39.88 C1.1 80.01,34.9 80.01,33.41 83.19,30.23 85.34,30.23
  Top 0.406: IC4.8 60.33,19.68 59.57,18.93 | J2.6 30.63,36.98 30.63,37.31 R19.1 | R20.1 38.53,27.81 | 22.46,25.89 U4.21 22.46,31.64 21.21,32.89 C2.1 21.21,36.19 23.62,38.61 | 22.46,25.89 21.66,25.09 U4.3 21.66,14.92 23.11,13.46 24.38,13.46 | U4.5 23.26,25.09 22.46,25.89 | X1.8 X1.7 X1.6 | 16.38,6.22 X1.6 | X1.6 X1.5 20.47,7.87 23.01,7.87 23.01,5.46 24.79,3.68 X1.10 25.68,2.41 26.19,1.9 40.01,1.9 | D3.C 98.27,43.99 97.34,43.05 92.13,43.05 91.75,43.43 J1.5 J1.3 J1.1 J5.5 J5.3 J5.1 90.17,31.75 88.9,30.48 88.9,29.21 87.63,27.94 | 24.38,13.46 25.4,13.46 32.87,20.93 R1.2 | Y2.2 24.38,13.46 | 86.84,27.15 87.63,27.94 | 87.63,27.94 85.34,30.23 84.96,30.23 | 59.69,44.69 59.69,43.31 60.71,42.29 77.47,42.29 79.88,39.88 | 59.69,44.69 S5.3 | C3.1 59.57,21.97 59.57,18.93 | 59.57,18.93 59.56,18.92 59.56,12.7 59.56,8.76 C4.1 R24.2 | 23.62,38.61 26.04,41.02 R19.2 | 59.69,44.69 59.69,47.88 59.18,48.39 19.05,48.39 16,45.34 | 48.11,27.81 48.23,27.94 48.23,24.76 49.02,23.98 R8.2 51.94,23.6 51.94,19.84 R10.2 48.13,19.71 R9.2 R32.2 | 48.11,27.81 48.23,27.81 48.23,31.09 50.16,33.02 52.7,33.02 | 48.11,27.81 R20.2 | IC5.8 63.52,33.66 R23.1 | R23.2 58.19,36.6 57.02,35.43 57.02,31.88 56.9,31.75 | 67.06,12.7 78.21,23.86 | 40.01,1.9 59.44,1.9 | R24.1 59.44,1.9 | 16,45.34 12.83,45.34 R12.E | 16,45.34 16.76,45.34 R31.2 | R31.1 23.5,38.61 23.62,38.61 | X2.8 X2.7 X2.6 X2.5 | 59.44,1.9 62.28,1.9 62.92,1.27 85.62,1.27 X2.10 86.77,4.83 82.55,4.83 81.28,6.1 X2.5 | X2.5 81.41,6.45 J6.4 | R32.1 43.18,5.08 40.01,1.9
H_SYNC
  Top 0.406: J6.2 72.52,8.51 71.12,7.11 71.12,5.46 71.75,4.83 78.49,4.83 79.68,3.63 X2.13
I/O0
  Top 0.254: IC1.25 86.51,22.21
  Top 0.406: J4.1 93.35,12.95 93.09,12.95 89.28,16.76 89.28,19.43 86.51,22.21
I/O1
  Top 0.254: 87.25,22.73 84.95,22.73
  Top 0.406: J4.2 92.71,15.24 90.17,17.78 90.17,19.81 87.25,22.73
I/O2
  Top 0.152: 93.47,17.78 J4.3
  Top 0.254: IC1.27 87.95,23.3
  Top 0.406: 87.95,23.3 93.47,17.78
I/O3
  Top 0.254: IC1.1 88.62,24.4
  Top 0.406: J4.4 92.71,20.32 88.62,24.4
I/O4
  Top 0.254: IC1.2 91.5,24.96
  Top 0.406: 91.5,24.96 J4.5
I/O5
  Top 0.152: 96.8,25.5 J4.6
  Top 0.254: IC1.3 96.8,25.5
I/O6
  Top 0.254: IC1.4 90.95,26.05
  Top 0.406: 90.95,26.05 92.84,27.94 J4.7
I/O7
  Top 0.254: IC1.5 89.47,26.61
  Top 0.406: J4.8 93.34,30.48 89.47,26.61
MISO
  Top 0.406: J2.1 27.98,28.2 U4.16
MOSI
  Top 0.254: 33.91,31.5 31.11,34.29 29.74,34.29 J2.4
  Top 0.406: U4.15 30.7,27.4 33.91,30.61 33.91,31.5
N$1
  Top 0.406: R5.2 33.02,9.5 29.79,6.27 X1.1
N$2
  Top 0.406: R7.2 30.73,10.13 27.05,6.45 X1.2
N$3
  Top 0.406: D3.A 94.13,46.36 83.97,46.36 R13.1
N$4
  Top 0.406: X1.13 17.45,2.29 16.56,1.4 10.16,1.4 7.62,3.94 7.62,9.04 R4.1
N$5
  Top 0.406: X1.14 13.56,4.83 9.4,4.83 8.89,5.33 8.89,7.26 13.82,12.19 R6.1
N$6
  Top 0.254: IC5.12 50.55,29.84 49.15,28.45 49.15,25.53 49.53,25.15 52.83,25.15 53.09,24.89 53.09,21.95 IC4.9
N$7
  Top 0.406: U4.7 24.86,19.14 23.24,17.53 23.24,16.57 Y2.1
N$8  (1 unrouted)
  Top 0.406: 25.67,21.44 25.67,16.6 Y2.3
N$9
  Top 0.406: IC5.14 52.05,27.3 R8.1
N$10
  Top 0.254: 46.2,13.72 53.59,13.72 53.98,13.33 IC4.14
  Top 0.406: R9.1 46.2,13.72
N$11
  Top 0.406: IC4.12 53.06,15.87 R10.1
N$12  (3 unrouted)
  Top 0.254: R2.2 48.28,15.39 47.71,15.96 41.7,15.96 41.4,16.26 41.4,17.91 42.86,19.37 43.05,19.56 46.48,22.99 R34.1 46.48,26.67 46.48,26.8
  Top 0.406: R2.2 49.53,17.8 50.14,18.41 IC4.10 | IC5.10 54.36,32.39 53.34,33.4 53.34,35.56 | 53.34,35.56 55.44,37.66 61.78,37.66 62.23,38.1 65.41,38.1 66.04,37.47 R15.2 | IC5.7 62.26,32.39 62.89,31.75 65.28,31.75 66.04,32.51 R15.1 | 53.34,35.56 50.8,35.56 46.48,31.24 46.48,29.84
N$13
  Top 0.254: 23.24,45.97 14.99,37.72 14.99,29.28
  Top 0.406: D1.A 52.17,43.05 57.02,43.05 57.15,43.18 S5.2 55.91,45.97 23.24,45.97 | U4.26 16.87,27.4 14.99,29.28
N$14
  Top 0.406: X2.1 91.57,6.55 J6.8
N$15
  Top 0.406: X2.2 89.28,11.56 J6.7
N$16
  Top 0.406: D2.A 32.43,25 U4.12
N$17
  Top 0.406: X1.3 24.31,6.48 28.45,10.62 R33.2
N$18
  Top 0.406: R1.1 36.22,22.1 36.22,24.21 D2.C
N$19  (1 unrouted)
N$23
  Top 0.406: X2.3 86.54,8.46 J6.6
N$86  (2 unrouted)
  Top 0.406: R12.S 2.54,37.34 4.7,35.18 13.97,35.18 | R30.2 16.79,34.8 20.86,30.73 U4.23
RST  (2 unrouted)
  Top 0.254: 21.34,43.56 15.49,37.72 15.49,32.77 | R21.2 38.7,42.35 38.54,42.35
  Top 0.406: J2.5 33.7,34.55 35.48,36.33 R3.1 37.73,37.09 39.24,38.61 | U4.29 19.92,25 20.32,25.4 20.32,27.94 15.49,32.77 | 39.24,41.66 38.54,42.35 37.34,43.56 21.34,43.56
SCK
  Top 0.406: U4.17 26.04,29.69 29.37,33.02 31.01,33.02 J2.3
V_SYNC
  Top 0.406: J6.1 73.79,11.68 69.85,7.75 69.85,5.21 72.77,2.29 74.93,2.29 | 75.41,2.29 74.93,2.29 | X2.14 76.94,3.28 75.95,2.29 74.93,2.29
VCC  (3 unrouted)
  Top 0.254: IC1.14 75.2,24.4 | C3.2 58.42,20.57 58.42,14.1 57.02,12.7 49.68,12.7 R2.1 | R12.A 16.89,40.13 23.62,46.86 | 62.48,4.95 57.4,4.95
  Top 0.406: IC5.16 55.35,23.5 56.74,22.1 C3.2 | U4.4 22.46,20.08 23.24,19.3 23.37,19.3 24.06,20 U4.6 24.13,21.18 24.13,24 24.86,24.73 U4.18 24.86,31.34 24.1,32.11 24.1,33.02 25.63,34.55 25.88,34.55 J2.2 24.26,36.18 24.26,37.21 28.96,41.91 30.66,41.91 R3.2 34.87,40.51 46.63,40.51 D1.C | R2.1 51.28,10.79 IC4.16 55.35,9.93 C4.2 56.64,5.72 57.4,4.95 | S5.1 52.24,44.73 50.3,42.8 47.9,42.8 46.76,41.66 D1.C | J5.4 J5.6 86.36,36.83 86.05,37.14 J1.2 J1.4 J1.6 86.05,43.43 85.54,42.93 80.37,42.93 79.6,43.69 R13.2 77.83,46.61 77.6,46.61 | J5.4 J5.2 | C1.2 77.9,32.64 79.47,31.07 | 79.47,31.07 80.06,30.48 80.06,29.26 75.2,24.4 | 23.62,46.86 57.78,46.86 58.04,46.61 | 58.04,46.61 58.42,46.23 58.42,42.55 58.04,42.16 53.72,42.16 50.29,38.73 47.37,38.73 46.76,39.35 D1.C | R27.1 79.47,31.07 | R27.2 83.15,34.29 J5.4 | R26.2 77.6,46.61 | 77.6,46.61 79.12,48.13 99.31,48.13 101.09,46.36 101.09,11.81 100.33,11.05 92.71,11.05 89.79,13.97 73.66,13.97 68.07,8.38 63.25,8.38 62.48,7.62 62.48,4.95 | R26.1 58.04,46.61
VGA_1  (4 unrouted)
  Top 0.254: U4.10 26.19,23.4 25.78,22.99 25.78,22.73 27.69,20.83
  Top 0.406: R5.1 32.89,13.74 32.89,17.27 31.88,18.29 | 27.69,20.83 29.59,20.83 30.61,19.81
VGA_2  (2 unrouted)
  Top 0.254: U4.11 25.85,24.2 25.15,23.5 25.15,22.86 26.54,21.46 26.54,20.27 26.67,20.14
  Top 0.406: R29.1 30.73,16.08 R7.1 | 26.67,20.14 R29.2
VGA_13
  Top 0.406: 19.96,21.21 U4.1 17.93,18.98 R4.2
VGA_14  (2 unrouted)
  Top 0.254: 38.86,24.64 38.86,15.87 37.49,14.5 R25.1 | 17.93,11.94 36.32,11.94
  Top 0.406: U4.13 37.7,25.8 38.86,24.64 | R6.2 17.93,11.94

### Text on the board
Top: WR | RD | !OE | 5V | GND | !WE | I/O 7 | ADC | CLK | EN | A8 | eeprom | IN/OUT | CLK | 2022 | A0 | marrs.io | I/O 0 | V | G | OUT | IN | H | B | R
tNames: AT28C256